# EAGLE design working (EAGLE 9.6.2)
COMPANY: ADAFRUIT INDUSTRIES; DRAWN: KTOWN; REV: A
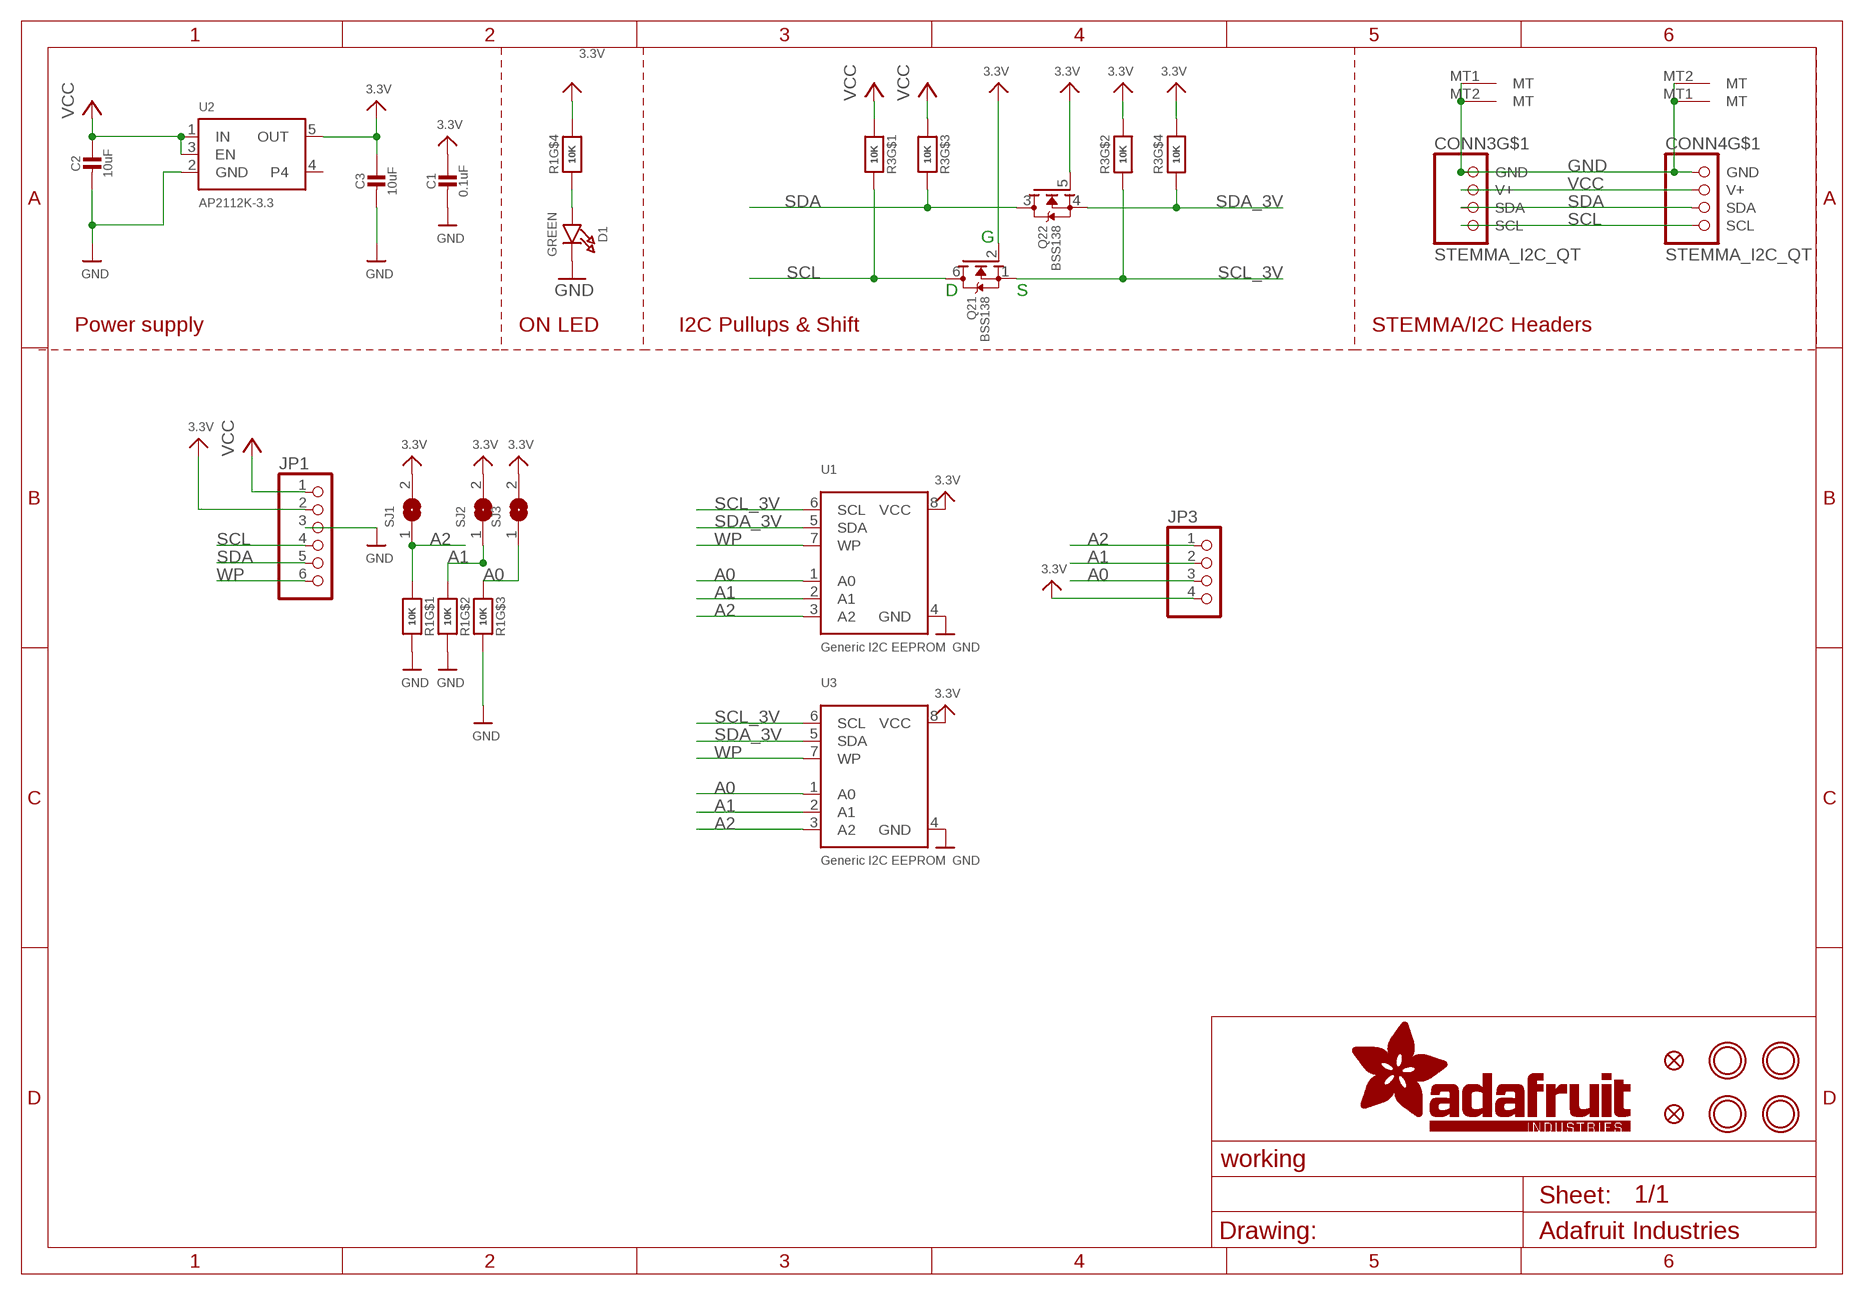
[diagram p0: schematic, sheet 1]

## Parts
C1  0.1uF  CAP_CERAMIC0603_NO  [0603-NO]
C2  10uF  CAP_CERAMIC0805-NOOUTLINE  [0805-NO]
C3  10uF  CAP_CERAMIC0805-NOOUTLINE  [0805-NO]
CONN3  STEMMA_I2C_QT  [JST_SH4]
CONN4  STEMMA_I2C_QT  [JST_SH4]
D1  GREEN  LED0603_NOOUTLINE  [CHIPLED_0603_NOOUTLINE]
FID3  FIDUCIAL_1MM  [FIDUCIAL_1MM]
FID4  FIDUCIAL_1MM  [FIDUCIAL_1MM]
JP1  HEADER-1X670MIL  [1X06_ROUND_70]
JP3  HEADER-1X4ROUND  [1X04_ROUND]
Q2  BSS138  MOSFET-N_DUAL  [SOT363]
R1  10K  RESISTOR_4PACK  [RESPACK_4X0603]
R3  10K  RESISTOR_4PACK  [RESPACK_4X0603]
SJ1  SOLDERJUMPER  [SOLDERJUMPER_ARROW_NOPASTE]
SJ2  SOLDERJUMPER  [SOLDERJUMPER_ARROW_NOPASTE]
SJ3  SOLDERJUMPER  [SOLDERJUMPER_ARROW_NOPASTE]
U1  Generic I2C EEPROM  EEPROM_I2C_8PIN_GENERIC  [SOIC8_150MIL]
U2  AP2112K-3.3  VREG_SOT23-5  [SOT23-5]
U3  Generic I2C EEPROM  EEPROM_I2C_8PIN_GENERIC_SON8  [USON8]
U$1  MOUNTINGHOLE2.5  [MOUNTINGHOLE_2.5_PLATED]
U$17  MOUNTINGHOLE2.5  [MOUNTINGHOLE_2.5_PLATED]
U$19  MOUNTINGHOLE2.5  [MOUNTINGHOLE_2.5_PLATED]
U$21  MOUNTINGHOLE2.5  [MOUNTINGHOLE_2.5_PLATED]

## Nets
3.3V [lowpower]: C1.1 C3.1 JP1.2 JP3.4 Q2.2(1:G) Q2.5(2:G) R1.5 R3.2 R3.4 SJ1.2 SJ2.2 SJ3.2 U1.8(VCC) U2.5(OUT) U3.8(VCC)
A0: JP3.3 R1.3 SJ3.1 U1.1(A0) U3.1(A0)
A1: JP3.2 R1.2 SJ2.1 U1.2(A1) U3.2(A1)
A2: JP3.1 R1.1 SJ1.1 U1.3(A2) U3.3(A2)
GND [highpower]: C1.2 C2.2 C3.2 CONN3.1(GND) CONN3.MT1(MT) CONN3.MT2(MT) CONN4.1(GND) CONN4.MT1(MT) CONN4.MT2(MT) D1.C JP1.3 R1.6 R1.7 R1.8 U1.4(GND) U2.2(GND) U3.4(GND)
N$1: D1.A R1.4
SCL: CONN3.4(SCL) CONN4.4(SCL) JP1.4 Q2.6(1:D) R3.8
SCL_3V: Q2.1(1:S) R3.7 U1.6(SCL) U3.6(SCL)
SDA: CONN3.3(SDA) CONN4.3(SDA) JP1.5 Q2.3(2:D) R3.6
SDA_3V: Q2.4(2:S) R3.5 U1.5(SDA) U3.5(SDA)
VCC [lowpower]: C2.1 CONN3.2(V+) CONN4.2(V+) JP1.1 R3.1 R3.3 U2.1(IN) U2.3(EN)
WP: JP1.6 U1.7(WP) U3.7(WP)
Unconnected: U2.4

## Notes on the sheet
- G
- D | S
- Power supply | ON LED | I2C Pullups & Shift | STEMMA/I2C Headers

## Library data of the parts
C1-C3 = microbuilder:CAP_CERAMIC: Ceramic Capacitors For new designs, use the packages preceded by an '_' character since they are more reliable: The following footprints should be used on most boards: _0402 - Standard footprint for regular board layouts _0603 - Standard footprint for regular board layouts _0805 - Standard footprint for regular board layouts _1206 - Standard footprint for regular board layouts For extremely tight-pitch boards where space is at a premium, the following 'micro-pitch' footprints can be used (smaller pads, no silkscreen outline, etc.): _0402MP - Micro-pitch footprint for very dense/compact boards _0603MP - Micro-pitch footprint for very dense/compact boards _0805MP - Micro-pitch footprint for very dense/compact boards _1206MP - Micro-pitch footprint for very dense/compact boards
CONN3 CONN4 = microbuilder:STEMMA_I2C
D1 = microbuilder:LED: LED 0603 - 0603 Surface Mount Package 2mA: Green LED - Low Power (3.9mcd, 2ma, 1.7Vf) - Digikey: 475-2709-2-ND Orange LED - Low Power (9.8mcd, 2ma, 1.8Vf) - Digikey: 475-1194-2-ND Red LED - Low Power (5mcd, 2ma, 1.8Vf) - Digikey: 475-1195-2-ND Yellow LED - Low Power (7mcd, 2ma, 1.8Vf) - Digikey: 475-1196-2-ND 5mA: Blue LED - Low Power (17mcd, 5ma, 2.9Vf) - Digikey: LNJ937W8CRACT-ND 0805 - 0805 Surface Mount Package 2mA: Red LED (8.8mcd, 2mA, 1.8Vf, Clear) - Low Power [Digikey: 475-2510-1-ND] Green LED (5mcd, 2mA, 1.8Vf, Clear) - Low Power [Digikey: 475-2730-1-ND] Yellow LED (11.3mcd, 2mA, 1.8Vf, Clear) - Low Power [Digikey: 475-2555-1-ND] 20mA: Red LED (104mcd, 20mA, Diffused) - LS R976 [Digikey: 475-1278-6-ND] Red LED (12mcd, 20mA, 2.0Vf, Clear) - APT2012EC [Digikey: 754-1128-1-ND] Green LED (15mcd, 20mA, 2.2Vf, Clear) - APT2012GC [Digikey: 754-1131-1-ND] Orange LED (160mcd, 20mA, 2.1Vf, Clear) - APT2012SECK [Digikey: 754-1130-1-ND] 1206 - 1206 Surface Mount Package Green LED (26mcd, 20mA, Diffused) - LG N971 [Digikey: 475-1407-6-ND] Red LED (15mcd, 20mA, Diffused) - LH N974 [Digikey: 475-1416-6-ND] Cree - Cree High-Power Surface Mount LEDs XPEBWT-L1-0000-00D50 - White 111lm 350mA 2.9Vf 6200K 110° XTEAWT-00-0000-00000LEE3 - White 114lm 350mA 2.85Vf 5000K 115° Everlight - Everlight 45-21 Series Surface Mount LEDs 45-21/QK2C-B2832AC2CB2/2T - Warm White 2000mcd 20mA 3.25Vf 3050K 120° 45-21/LK2C-B38452C4CB2/2T - Nuetral White 2000mcd 20mA 3.25Vf 4150K 120° 45-21/LK2C-B50634C6CB2/2T - Cold White 2200mcd 20mA 3.25Vf 5650K 120° PLCC2 Reverse Mount LS T77K-J1L2-1-0-2-R18-Z - Red 11.25mcd 2mA 1.8Vf 630nm 120° LO T77K-L1M2-24-Z - Orange 19.6mcd 2mA 1.8Vf 606nm 120° LY T77K-K2M1-26-Z - Yellow 15.7mcd 2mA 1.8Vf 587nm 120°
FID3 FID4 = microbuilder:FIDUCIAL: Fiducial Alignment Points Various fiducial points for machine vision alignment.; BOM: EXCLUDE
JP1 = microbuilder:HEADER-1X6: PIN HEADER
JP3 = microbuilder:HEADER-1X4: PIN HEADER
Q2 = microbuilder:MOSFET-N_DUAL: Dual N-Channel MOSFET SOT363 (2.0x1.25mm) 2N7002PS - 60V, 320mA [Digikey: 568-5984-1-ND]
R1 R3 = microbuilder:RESISTOR_4PACK: Resistor Packs (4 resistors) 4 x 0603 10K 1/16W - Digikey: YC164J-10KCT-ND
SJ1-SJ3 = microbuilder:SOLDERJUMPER: SMD Solder JUMPER Solder the two pads together to create a connection, or remove the solder to break it. REFLOW - Use this footprint for solder paste and reflow ovens. WAVE - Use this footprint for hand-soldering (larger pads). CLOSED - Has a trace between the two pads to ensure it is closed by default. The trace needs to be cut to disable the jumper, and can be closed again by creating a solder bridge between the two pads.; BOM: EXCLUDE
U1 U3 = microbuilder:EEPROM_I2C_8PIN_GENERIC: Note: The same pinout is used for many I2C EEPROMs in SOIC8(150mil) from a variety of manufacturers and in various sizes. Examples: 16K (2K x 8 Bit) I2C EEPROM 1.7-5.5V, 400KHz, -40°C-85°C Digikey: CAT24C16WI-GT3CT-ND 256K (32K x 8 Bit) I2C EEPROM 1.7-5.5V, 400KHz, -40°C-85°C Digikey: 24AA256-I/SN-ND
U2 = microbuilder:VREG_SOT23-5: SOT23-5 Fixed Voltage Regulators Part Current Out V Out V In V Dropout θJA (°C/W) TJ (°C) Digikey Part No. ADP121 150mA 3.3V 3.4-5.5V 0.09V @ 150mA -- -- ADP121-AUJZ33R7CT-ND ADP121 150mA 3.0V 3.1-5.5V 0.09V @ 150mA -- -- ADP121-AUJZ30R7CT-ND ADP122 300mA 3.3V 3.4-5.5V 0.085V @ 300mA -- -- ADP122AUJZ-3.3-R7CT-ND ADP1712 300mA 3.3V 3.5-5.5V 0.17V @ 300mA -- -- ADP1712AUJZ-3.3-R7TR-ND AP7311 (Low Cost) 150mA 3.3V 3.5-6V 0.15V @ 150mA -- -- AP7311-33WG-7DICT-ND LD39015M18R 150mA 1.8V 1.9V-5.5V 0.08V @ 100mA -- -- 497-6977-1-ND LP2985A-33DBVR 150mA 3.3V 3.3-16V 0.28V @ 150mA 206 150 296-18479-1-ND MCP1824T-3302E/OT 300mA 3.3V 3.5V-6V 0.2V @ 300mA -- -- MCP1824T-3302E/OTCT-ND MIC5205-2.5YM5 TR 150mA 2.5V 2.7-16V 0.165V @ 150mA -- -- 576-1257-2-ND MIC5205-3.0YM5 TR 150mA 3.0V 3.2V-16V 0.165V @ 150mA -- -- 576-1258-2-ND MIC5205-3.3YM5 TR 150mA 3.3V 3.5V-16V 0.165V @ 150mA -- -- 576-1259-2-ND TPS780330220 150mA 3.3V+2.2V 3.6-5.5V 250mV Max -- -- 296-23332-1-ND TDA3663/N1,135 100mA 3.3V 3.5-45V 0.18V @ 50mA -- -- 568-5343-1-ND Max operating temp can be calculated using θJA, TJ (max junction temperature), and power in watts. Set the "Maximum Ambient Temperature" until it reaches TJ ("Max Junction Temperature"), which is the absolute limit for safe use of the regulator: Heat Sink Temperature Calculator <http://www.daycounter.com/Calculators/Heat-Sink-Temperature-Calculator.phtml> For example, With 12V source into a 3.3V LP2985 and a 30mA load, we are dissipating (12V-3.3V) * 0.03A = 0.261W. With a θJA of 206 °C/W, a TJ of 150°C, and 261mW we can safely use the chip without a heat sink up to 75°C (=147.1°C Junction Temperature).
U$1 U$17 U$19 U$21 = microbuilder:MOUNTINGHOLE: Mounting Hole For #2 screws (0.086"/2.18mm width, 0.094"/2.4mm hole) use 2.5mm; BOM: EXCLUDE

## Net classes
1 highpower: width 0.305 mm, drill 0.483 mm
2 lowpower: width 0.305 mm, drill 0.483 mm

## Board
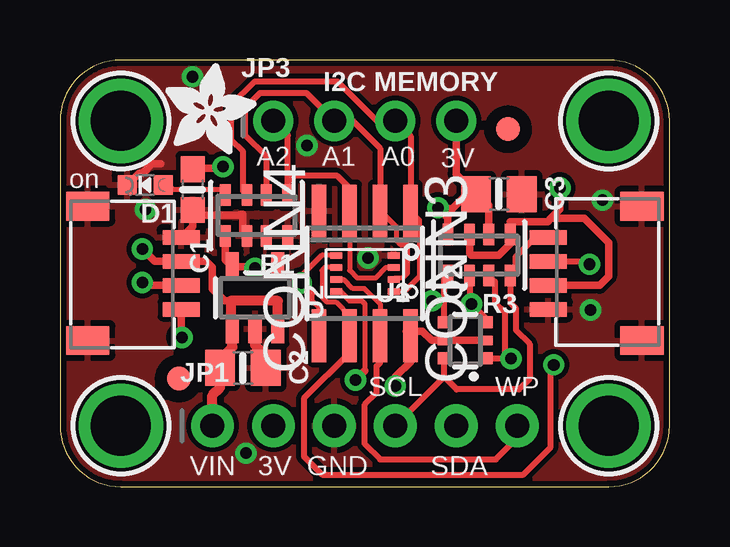
[diagram p1: board, top side]
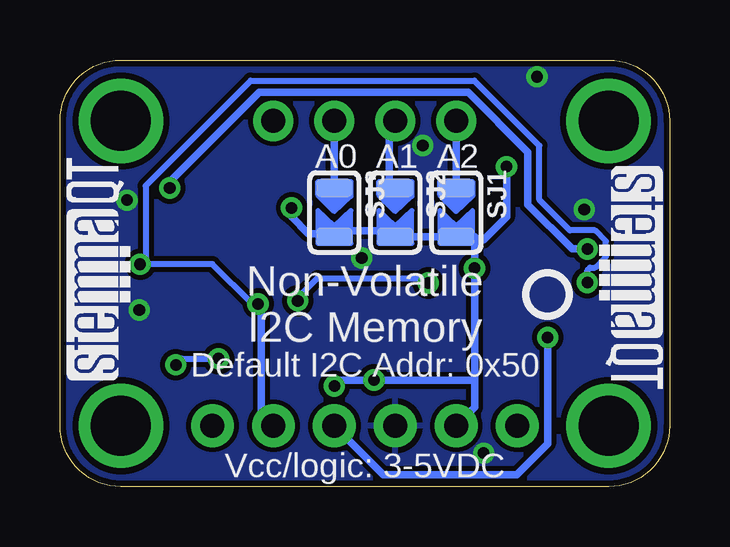
[diagram p2: board, bottom side, seen from below]

Size 25.4 x 17.78 mm. Coordinates in mm from the lower left corner, seen from the top.
Outline: 0,15.24 0,2.54 arc90 2.54,0 22.86,0 arc90 25.4,2.54 25.4,15.24 arc90 22.86,17.78 2.54,17.78 arc90 0,15.24
Copper layers (1*16): Top 0.035mm / dielectric 1.5mm / Bottom 0.035mm
Design rules "adafruit *": minimum track width 8mil, minimum drill 15.5mil, track to track 8mil, track to pad 8mil, pad to pad 8mil, via to via 8mil, smd to smd 8mil, copper to edge 10mil, drill to drill 8mil, minimum pad ring 10mil, minimum via ring 8mil, stop-mask expansion 2mil, vias tented up to drill 20mil, thermal gap 10mil

### Footprints (pad centres in the part's own frame; a part is rotated, then mirrored left to right if it is on the bottom)
0603-NO = smd 1.075 x 1: 1 -0.85,0; 2 0.85,0
0805-NO = smd 1.24 x 1.5: 1 -0.95,0; 2 0.95,0
JST_SH4 = smd 0.6 x 1.55: 1 -1.5,2.514; 2 -0.5,2.514; 3 0.5,2.514; 4 1.5,2.514 | smd 1.2 x 1.8: MT1 -2.8,-1.386; MT2 2.8,-1.386
CHIPLED_0603_NOOUTLINE = smd 0.8 x 0.8: A 0,-0.75; C 0,0.75
FIDUCIAL_1MM = smd 1 x 1: 1 0,0
1X06_ROUND_70 = drill 1 pad 1.778: 1 -6.35,0; 2 -3.81,0; 3 -1.27,0; 4 1.27,0; 5 3.81,0; 6 6.35,0
1X04_ROUND = drill 1 pad 1.676: 1 -3.81,0; 2 -1.27,0; 3 1.27,0; 4 3.81,0
SOT363 = smd 0.5 x 0.5: 1 -0.75,-0.9; 3 0.75,-0.9; 4 0.75,0.9; 6 -0.75,0.9 | smd 0.4 x 0.5: 2 0,-0.9; 5 0,0.9
RESPACK_4X0603 = smd 0.45 x 0.9: 1 -1.3,-0.85; 2 -0.4,-0.85; 3 0.4,-0.85; 4 1.3,-0.85; 5 1.3,0.85; 6 0.4,0.85; 7 -0.4,0.85; 8 -1.3,0.85
SOLDERJUMPER_ARROW_NOPASTE = smd 0.762 x 1.524: 1 -1.016,0; 2 1.016,0
SOIC8_150MIL = smd 0.6 x 2.2: 1 -1.905,-2.6; 2 -0.635,-2.6; 3 0.635,-2.6; 4 1.905,-2.6; 5 1.905,2.6; 6 0.635,2.6; 7 -0.635,2.6; 8 -1.905,2.6
SOT23-5 = smd 0.55 x 1.2: 1 -0.95,-1.3; 2 0,-1.3; 3 0.95,-1.3; 4 0.95,1.3; 5 -0.95,1.3
USON8 = smd 0.5 x 0.275: 1 -1.2,0.75; 2 -1.2,0.25; 3 -1.2,-0.25; 4 -1.2,-0.75; 5 1.2,-0.75; 6 1.2,-0.25; 7 1.2,0.25; 8 1.2,0.75
MOUNTINGHOLE_2.5_PLATED = drill 2.5 pad 3.2: P$1 0,0

### Placement (x,y rotation side)
C1  5.52,12.38 270 top
C2  7.62,4.95 0 top
C3  18.29,12.19 0 top
CONN3  22.86,8.89 90 top
CONN4  2.54,8.89 270 top
D1  3.56,12.57 90 top
FID3  4.95,4.51 0 top
FID4  18.67,14.9 0 top
JP1  12.7,2.54 0 top
JP3  12.7,15.24 0 top
Q2  16.89,6.1 90 top
R1  8.19,11.3 180 top
R3  17.46,9.65 180 top
SJ1  8.89,11.43 270 bottom
SJ2  11.43,11.43 270 bottom
SJ3  13.97,11.43 270 bottom
U1  12.7,8.89 180 top
U2  8.13,7.87 0 top
U3  12.7,8.89 180 top
U$1  2.54,15.24 0 top
U$17  22.86,15.24 0 top
U$19  2.54,2.54 0 top
U$21  22.86,2.54 0 top
U$25  [PCBFEAT-REV-040]  5.08,8 0 bottom
U$30  [STEMMAQT]  22.48,4.44 90 bottom
U$31  [STEMMAQT]  2.92,13.33 270 bottom
U$32  [ADAFRUIT_3.5MM]  4.38,13.84 0 top

### Tracks (layer width: path | path; a pad name or v marks a point on that pad's centre or on a via)
3.3V  (via drill 0.48)
  Top 0.203: U3.8 11.67,8.14 12.07,7.75 12.57,7.75 12.7,7.62 12.7,4.83
  Top 0.305: Q2.2 Q2.5 15.48,6.1 15.1,6.48 14.42,6.48 U1.8 14.61,5.21 13.97,4.57 v13.97,4.19 | v8.13,9.11 8.06,9.17 U2.5 6.89,9.46 R1.5 | JP3.4 16.51,13.02 C3.1 17.37,12.22 | R3.4 16.16,11.21 15.78,11.59 | 15.78,11.59 v15.75,11.62 | 15.78,11.59 16.35,11.59 17.18,12.41 17.37,12.22 | R3.2 17.86,11.73 17.37,12.22 | 12.7,4.83 v12.32,4.44 | C1.1 5.56,13.27 6.73,13.27 v6.79,13.33
  Bottom 0.305: v15.75,11.62 15.75,11.24 15.05,10.54 14.1,10.54 | JP1.2 8.13,3.3 8.13,4.38 | v13.97,4.19 13.72,4.44 v12.32,4.44 8.19,4.44 8.13,4.38 | 14.1,10.54 13.84,10.54 | 14.1,10.54 SJ3.2 13.84,10.54 | 13.84,10.54 13.72,10.67 11.68,10.67 SJ2.2 SJ1.2 8.13,10.41 8.13,10.29 | 8.13,10.29 v8.13,9.11 8.13,4.38 | v6.79,13.33 6.79,11.24 7.75,10.29 8.13,10.29
A0
  Top 0.203: U3.1 14.36,8.14 14.99,8.76 14.99,11.11 U1.1
  Top 0.254: U1.1 14.61,14.61 JP3.3 13.21,15.24 11.56,16.89 8.13,16.89 7.12,15.89 7.12,14.47 7.62,13.97 7.62,12.32 R1.3
  Bottom 0.305: SJ3.1 JP3.3
A1
  Top 0.203: U3.2 13.96,8.7 14.28,8.7 14.48,8.9 14.48,10.09 14.18,10.09 14,10.26 14,10.82 U1.2
  Top 0.254: U1.2 13.34,14.1 12.19,15.24 JP3.2 10.26,16.41 8.34,16.41 7.71,15.78 7.71,14.64 8.59,13.76 R1.2
  Bottom 0.305: SJ2.1 11.68,12.7 11.68,14.99 JP3.2
A2
  Top 0.203: U3.3 13.58,9.14 13.14,8.7 12.39,8.7 12.07,9.02 U1.3
  Top 0.254: U1.3 12.07,12.45 11.56,12.95 9.78,12.95 9.49,12.67 R1.1 9.49,14.64 JP3.1
  Bottom 0.305: SJ1.1 8.87,12.47 8.86,12.48 8.89,12.51 JP3.1
GND  (via drill 0.48)
  Top 0.305: D1.C 3.31,13.07 3.44,13.07 3.83,13.46 4.19,13.46 | CONN4.1 5.53,10.86 C1.2 5.75,11.3 7.49,11.3 7.54,11.35 7.62,11.35 7.62,10.62 R1.6
  Top 0.406: C2.2 8.57,5.46 8.13,5.9 U2.2
  other vias: 3.56,11.56 22.1,7.37 22.61,11.94 12.83,9.52 7.75,1.4 10.29,14.22 5.52,17.08
  pour Top: 0,17.78 25.4,17.78 25.4,0 0,0
  pour Bottom: 0,17.78 25.4,17.78 25.4,0 0,0
N$1
  Top 0.203: D1.A 4.53,12.57 4.71,12.39 6.72,12.39 6.89,12.22
  Top 0.254: 6.89,12.22 R1.4
SCL  (via drill 0.48)
  Top 0.254: Q2.6 15.99,4.56 | 15.99,4.56 16,4.57 16.52,4.05 19.12,4.05 19.57,4.51 19.57,5.96 19,6.53 19,7.43 18.76,7.67 R3.8 18.99,9.03 18.99,9.57 19.8,10.39 CONN3.4 | 15.99,4.56 JP1.4
  Top 0.305: CONN4.4 5.05,6.25 v5.08,6.22
  Bottom 0.305: JP1.4 11.94,0.51 6.37,0.51 5.08,1.8 v5.08,6.22
SCL_3V  (via drill 0.48)
  Top 0.203: U3.6 11.04,9.14 10.92,9.02 10.92,7.9 11.12,7.7 11.48,7.7 12.07,7.11 U1.6
  Top 0.254: R3.7 18.12,8.55 18.12,7.66 18.54,7.24 18.54,5.59 | 18.54,5.59 18.54,5.46 18.43,5.35 Q2.1 | v18.8,5.33 18.54,5.59 | U1.6 12.07,5.59 10.16,3.68 10.16,1.27 10.92,0.51 19.3,0.51 20.45,1.65 20.45,4.95 v20.57,5.08
  Bottom 0.254: v18.8,5.33 20.32,5.33 v20.57,5.08
SDA  (via drill 0.48)
  Top 0.254: R3.6 17.06,7.7 v17.14,7.62 17.79,6.97 Q2.3 | CONN3.3 21.94,9.39 v22.06,9.27
  Top 0.305: CONN4.3 3.55,8.39 v3.43,8.51
  Bottom 0.254: v3.43,8.51 3.43,9.02 3.32,9.13 3.11,9.13 2.65,9.59 2.65,10.23 3.11,10.68 4.16,10.68 5.42,11.95 5.42,14.21 8.13,16.92 17.45,16.92 21.83,12.54 21.83,9.46 22.02,9.27 v22.06,9.27 19.05,9.27 17.4,7.62 v17.14,7.62
  Bottom 0.305: v17.14,7.62 17.02,7.49 17.02,3.05 JP1.5
SDA_3V  (via drill 0.48)
  Top 0.203: U3.5 10.91,9.64 10.05,8.78 v10.05,8.49 10.52,8.03 10.52,7.73 10.79,7.45 U1.5
  Top 0.254: R3.5 15.99,8.63 15.99,7.75 | 15.99,7.75 Q2.4 | v15.49,7.75 15.99,7.75
  Bottom 0.254: v10.05,8.49 10.25,8.69 14.68,8.69 15.49,7.87 v15.49,7.75
VCC  (via drill 0.48)
  Top 0.305: R3.3 17.06,9.73 17.14,9.65 18.29,9.65 18.76,10.13 R3.1 18.76,11.05 20.32,11.05 20.45,11.18 | 20.45,11.18 21.84,11.18 22.86,10.16 22.86,8.76 22.49,8.39 CONN3.2 | v3.43,9.91 3.95,9.39 CONN4.2 6.1,9.39 6.35,9.14 6.35,8.26 6.86,7.75 7.11,7.75 | v20.83,12.45 20.83,11.56 20.45,11.18
  Top 0.406: U2.3 9.08,7.75 7.11,7.75 7.11,6.64 U2.1 7.18,5.81 6.67,5.3 C2.1 6.67,4.13 6.35,3.81 JP1.1
  Bottom 0.305: v20.83,12.45 20.83,12.7 17.09,16.43 8.4,16.43 5.91,13.94 5.91,11.75 4.06,9.91 v3.43,9.91
WP
  Top 0.203: U3.7 11.82,8.64 12.2,8.26 12.7,8.26 13.34,7.62 U1.7 13.34,5.16
  Top 0.254: JP1.6 19.05,2.03 18.16,1.14 13.34,1.14 12.7,1.78 12.7,3.43 13.2,3.92 13.2,5.02 13.34,5.16

### Text on the board
tPlace: I2C MEMORY | A2 | A1 | A0 | 3V | on | SCL | WP | VIN | 3V | GND | SDA
bPlace: A2 | A1 | A0 | Non-Volatile / I2C Memory | Default I2C Addr: 0x50 | Vcc/logic: 3-5VDC